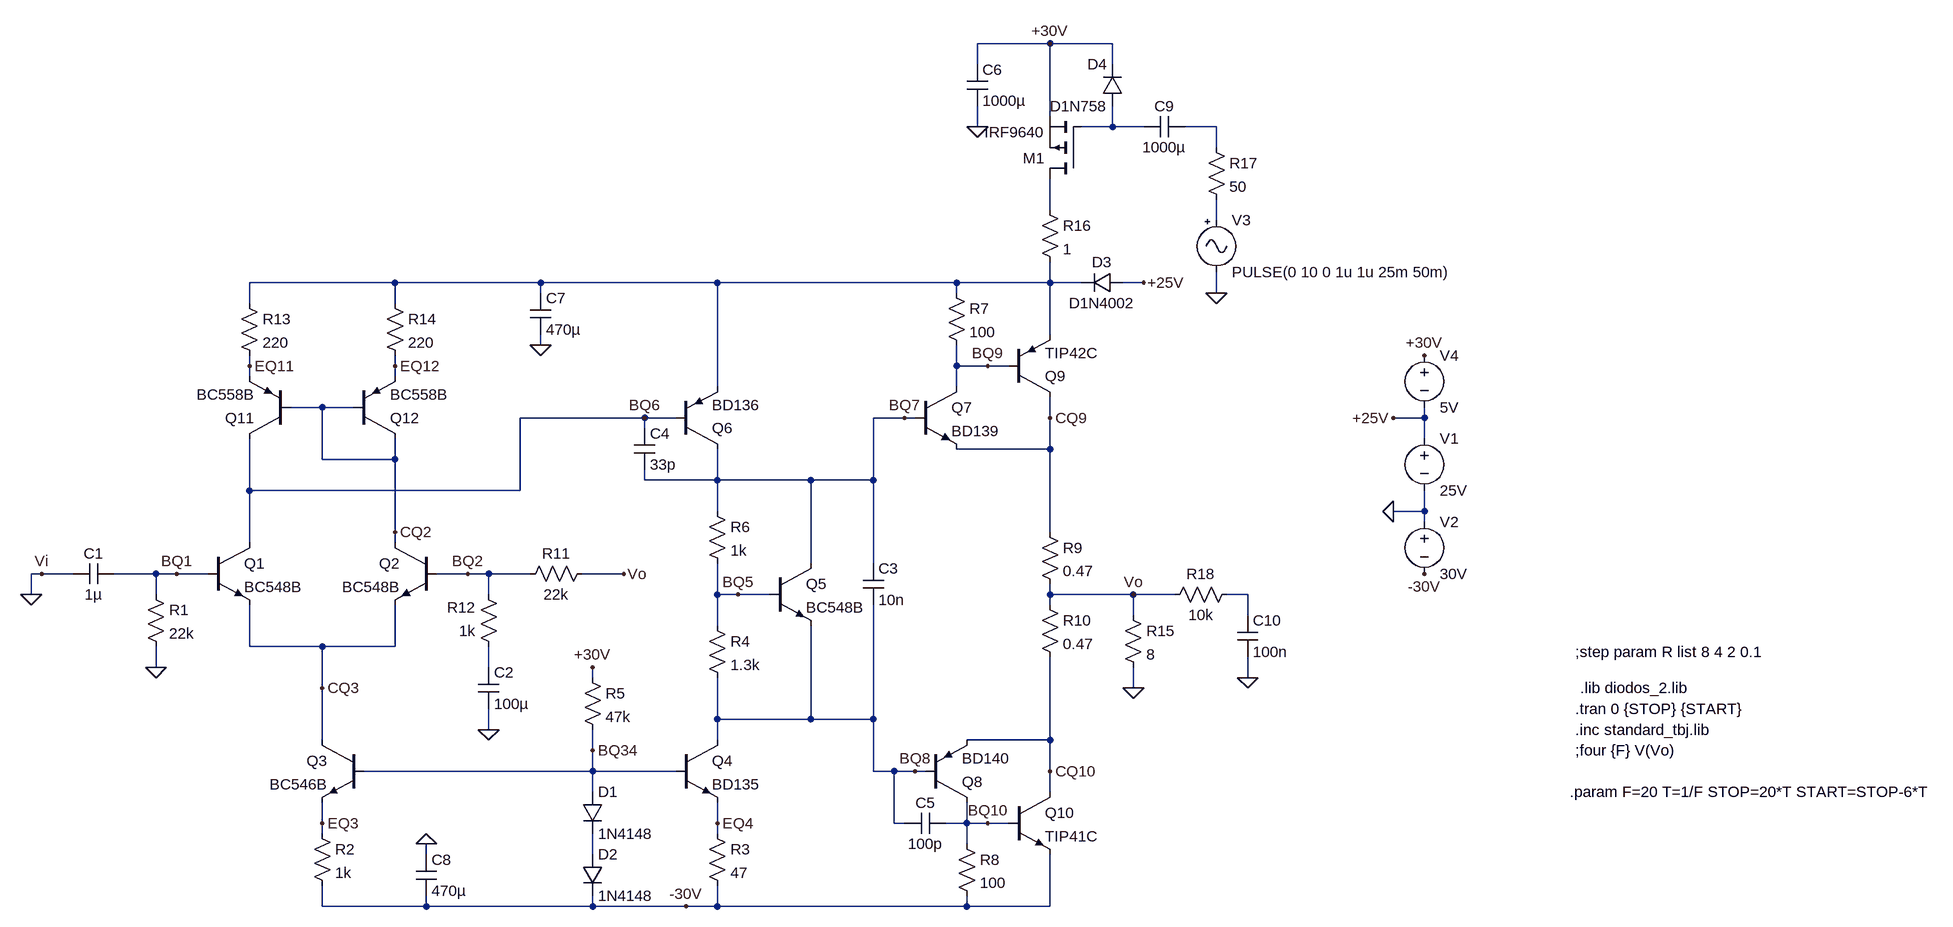
[diagram p0: schematic Clase_B_RRF.asc]
Clase_B_RRF.asc, the LTspice schematic file:
Version 4
SHEET 1 2500 1108
WIRE 1104 -592 992 -592
WIRE 1200 -592 1104 -592
WIRE 992 -560 992 -592
WIRE 1200 -560 1200 -592
WIRE 1104 -480 1104 -592
WIRE 992 -464 992 -496
WIRE 1200 -464 1200 -496
WIRE 1200 -464 1152 -464
WIRE 1248 -464 1200 -464
WIRE 1360 -464 1312 -464
WIRE 1360 -432 1360 -464
WIRE 1104 -336 1104 -384
WIRE 1360 -320 1360 -352
WIRE 96 -224 -128 -224
WIRE 320 -224 96 -224
WIRE 592 -224 320 -224
WIRE 960 -224 592 -224
WIRE 1104 -224 1104 -256
WIRE 1104 -224 960 -224
WIRE 1152 -224 1104 -224
WIRE 1248 -224 1216 -224
WIRE 320 -208 320 -224
WIRE 960 -208 960 -224
WIRE 1360 -208 1360 -240
WIRE -128 -192 -128 -224
WIRE 96 -192 96 -224
WIRE 1104 -144 1104 -224
WIRE 320 -128 320 -144
WIRE -128 -96 -128 -112
WIRE 96 -96 96 -112
WIRE 960 -96 960 -128
WIRE 1008 -96 960 -96
WIRE 1040 -96 1008 -96
WIRE -128 -80 -128 -96
WIRE 96 -80 96 -96
WIRE 592 -64 592 -224
WIRE 960 -64 960 -96
WIRE -16 -32 -64 -32
WIRE 32 -32 -16 -32
WIRE 480 -16 288 -16
WIRE 528 -16 480 -16
WIRE 880 -16 832 -16
WIRE 896 -16 880 -16
WIRE 1104 -16 1104 -48
WIRE 1680 -16 1680 -32
WIRE 1680 -16 1632 -16
WIRE 480 0 480 -16
WIRE 1680 16 1680 -16
WIRE 1104 32 1104 -16
WIRE 1104 32 960 32
WIRE -16 48 -16 -32
WIRE 96 48 96 16
WIRE 96 48 -16 48
WIRE 480 80 480 64
WIRE 592 80 592 32
WIRE 592 80 480 80
WIRE 736 80 592 80
WIRE 832 80 832 -16
WIRE 832 80 736 80
WIRE -128 96 -128 16
WIRE 288 96 288 -16
WIRE 288 96 -128 96
WIRE 592 128 592 80
WIRE 1680 128 1680 96
WIRE 1680 128 1632 128
WIRE 1680 144 1680 128
WIRE 96 160 96 48
WIRE 1104 160 1104 32
WIRE -128 176 -128 96
WIRE 96 176 96 160
WIRE 736 208 736 80
WIRE 832 208 832 80
WIRE -448 224 -464 224
WIRE -400 224 -448 224
WIRE -272 224 -336 224
WIRE -240 224 -272 224
WIRE -192 224 -240 224
WIRE 208 224 160 224
WIRE 240 224 208 224
WIRE 304 224 240 224
WIRE 448 224 384 224
WIRE -464 256 -464 224
WIRE -272 256 -272 224
WIRE 240 256 240 224
WIRE 592 256 592 208
WIRE 624 256 592 256
WIRE 672 256 624 256
WIRE 1104 256 1104 240
WIRE 1232 256 1104 256
WIRE 1296 256 1232 256
WIRE 1408 256 1376 256
WIRE 1104 272 1104 256
WIRE 1232 288 1232 256
WIRE 1408 288 1408 256
WIRE 592 304 592 256
WIRE -128 336 -128 272
WIRE -16 336 -128 336
WIRE 96 336 96 272
WIRE 96 336 -16 336
WIRE -272 368 -272 336
WIRE 240 368 240 336
WIRE 400 384 400 368
WIRE 1408 384 1408 352
WIRE -16 400 -16 336
WIRE 1232 400 1232 368
WIRE 592 448 592 384
WIRE 736 448 736 304
WIRE 736 448 592 448
WIRE 832 448 832 272
WIRE 832 448 736 448
WIRE 240 464 240 432
WIRE -16 480 -16 400
WIRE 592 480 592 448
WIRE 1104 480 1104 352
WIRE 1104 480 976 480
WIRE 400 496 400 464
WIRE 400 528 400 496
WIRE 400 528 48 528
WIRE 528 528 400 528
WIRE 832 528 832 448
WIRE 864 528 832 528
WIRE 896 528 864 528
WIRE 912 528 896 528
WIRE 1104 528 1104 480
WIRE 400 560 400 528
WIRE 1104 560 1104 528
WIRE -16 608 -16 576
WIRE 592 608 592 576
WIRE 864 608 864 528
WIRE 880 608 864 608
WIRE 976 608 976 576
WIRE 976 608 944 608
WIRE 1008 608 976 608
WIRE 1040 608 1008 608
WIRE -16 624 -16 608
WIRE 592 624 592 608
WIRE 976 640 976 608
WIRE 144 656 144 640
WIRE 400 656 400 624
WIRE -16 736 -16 704
WIRE 144 736 144 720
WIRE 144 736 -16 736
WIRE 400 736 400 720
WIRE 400 736 144 736
WIRE 544 736 400 736
WIRE 592 736 592 704
WIRE 592 736 544 736
WIRE 976 736 976 720
WIRE 976 736 592 736
WIRE 1104 736 1104 656
WIRE 1104 736 976 736
FLAG 1632 128 0
FLAG 1680 -112 +30V
FLAG 1104 -592 +30V
FLAG 1680 224 -30V
FLAG 544 736 -30V
FLAG 240 464 0
FLAG -464 256 0
FLAG 1232 256 Vo
FLAG -448 224 Vi
FLAG 480 -16 BQ6
FLAG -16 400 CQ3
FLAG -16 608 EQ3
FLAG 400 496 BQ34
FLAG 592 608 EQ4
FLAG 880 -16 BQ7
FLAG 896 528 BQ8
FLAG 1008 -96 BQ9
FLAG 1008 608 BQ10
FLAG 1104 528 CQ10
FLAG 1104 -16 CQ9
FLAG -272 368 0
FLAG 448 224 Vo
FLAG -128 -96 EQ11
FLAG 96 -96 EQ12
FLAG 96 160 CQ2
FLAG 208 224 BQ2
FLAG -240 224 BQ1
FLAG 624 256 BQ5
FLAG 1232 400 0
FLAG 400 368 +30V
FLAG 320 -128 0
FLAG 144 640 0
FLAG 1360 -208 0
FLAG 1632 -16 +25V
FLAG 992 -464 0
FLAG 1248 -224 +25V
FLAG 1408 384 0
SYMBOL npn -192 176 R0
SYMATTR InstName Q1
SYMATTR Value BC548B
SYMBOL npn 160 176 M0
SYMATTR InstName Q2
SYMATTR Value BC548B
SYMBOL npn 48 480 M0
SYMATTR InstName Q3
SYMATTR Value BC546B
SYMBOL npn 528 480 R0
SYMATTR InstName Q4
SYMATTR Value BD135
SYMBOL npn 672 208 R0
SYMATTR InstName Q5
SYMATTR Value BC548B
SYMBOL pnp 528 32 M180
SYMATTR InstName Q6
SYMATTR Value BD136
SYMBOL res 576 112 R0
SYMATTR InstName R6
SYMATTR Value 1k
SYMBOL res 576 288 R0
SYMATTR InstName R4
SYMATTR Value 1.3k
SYMBOL diode 384 560 R0
SYMATTR InstName D1
SYMATTR Value 1N4148
SYMBOL diode 384 656 R0
SYMATTR InstName D2
SYMATTR Value 1N4148
SYMBOL res -32 608 R0
SYMATTR InstName R2
SYMATTR Value 1k
SYMBOL res 576 608 R0
SYMATTR InstName R3
SYMATTR Value 47
SYMBOL res 384 368 R0
SYMATTR InstName R5
SYMATTR Value 47k
SYMBOL voltage 1680 0 R0
WINDOW 123 0 0 Left 2
WINDOW 39 0 0 Left 2
SYMATTR InstName V1
SYMATTR Value 25V
SYMBOL voltage 1680 128 R0
SYMATTR InstName V2
SYMATTR Value 30V
SYMBOL res 1088 144 R0
SYMATTR InstName R9
SYMATTR Value 0.47
SYMBOL res 1088 256 R0
SYMATTR InstName R10
SYMATTR Value 0.47
SYMBOL npn 896 -64 R0
SYMATTR InstName Q7
SYMATTR Value BD139
SYMBOL pnp 1040 -48 M180
SYMATTR InstName Q9
SYMATTR Value TIP42C
SYMBOL res 944 -224 R0
SYMATTR InstName R7
SYMATTR Value 100
SYMBOL pnp 912 576 M180
SYMATTR InstName Q8
SYMATTR Value BD140
SYMBOL npn 1040 560 R0
SYMATTR InstName Q10
SYMATTR Value TIP41C
SYMBOL res 960 624 R0
SYMATTR InstName R8
SYMATTR Value 100
SYMBOL res 400 208 R90
WINDOW 0 0 56 VBottom 2
WINDOW 3 32 56 VTop 2
SYMATTR InstName R11
SYMATTR Value 22k
SYMBOL res 256 352 R180
WINDOW 0 36 76 Left 2
WINDOW 3 36 40 Left 2
SYMATTR InstName R12
SYMATTR Value 1k
SYMBOL cap 464 0 R0
SYMATTR InstName C4
SYMATTR Value 33p
SYMBOL cap 224 368 R0
SYMATTR InstName C2
SYMATTR Value 100µ
SYMBOL cap -400 240 R270
WINDOW 0 32 32 VTop 2
WINDOW 3 0 32 VBottom 2
SYMATTR InstName C1
SYMATTR Value 1µ
SYMBOL res -288 240 R0
SYMATTR InstName R1
SYMATTR Value 22k
SYMBOL pnp -64 16 R180
SYMATTR InstName Q11
SYMATTR Value BC558B
SYMBOL pnp 32 16 M180
SYMATTR InstName Q12
SYMATTR Value BC558B
SYMBOL res -144 -208 R0
SYMATTR InstName R13
SYMATTR Value 220
SYMBOL res 80 -208 R0
SYMATTR InstName R14
SYMATTR Value 220
SYMBOL cap 944 592 R90
WINDOW 0 0 32 VBottom 2
WINDOW 3 32 32 VTop 2
SYMATTR InstName C5
SYMATTR Value 100p
SYMBOL res 1216 272 R0
SYMATTR InstName R15
SYMATTR Value 8
SYMBOL cap 816 208 R0
SYMATTR InstName C3
SYMATTR Value 10n
SYMBOL cap 304 -208 R0
SYMATTR InstName C7
SYMATTR Value 470µ
SYMBOL cap 128 656 R0
SYMATTR InstName C8
SYMATTR Value 470µ
SYMBOL Misc\\signal 1360 -336 R0
WINDOW 123 0 0 Left 0
WINDOW 39 0 0 Left 0
SYMATTR InstName V3
SYMATTR Value PULSE(0 10 0 1u 1u 25m 50m)
SYMBOL pmos 1152 -384 R180
SYMATTR InstName M1
SYMATTR Value IRF9640
SYMBOL res 1088 -352 R0
SYMATTR InstName R16
SYMATTR Value 1
SYMBOL diode 1216 -240 R90
WINDOW 0 0 32 VBottom 2
WINDOW 3 32 32 VTop 2
SYMATTR InstName D3
SYMATTR Value D1N4002
SYMBOL diode 1216 -496 R180
WINDOW 0 24 64 Left 2
WINDOW 3 24 0 Left 2
SYMATTR InstName D4
SYMATTR Value D1N758
SYMBOL cap 976 -560 R0
SYMATTR InstName C6
SYMATTR Value 1000µ
SYMBOL cap 1312 -480 R90
WINDOW 0 0 32 VBottom 2
WINDOW 3 32 32 VTop 2
SYMATTR InstName C9
SYMATTR Value 1000µ
SYMBOL res 1344 -448 R0
SYMATTR InstName R17
SYMATTR Value 50
SYMBOL voltage 1680 -128 R0
SYMATTR InstName V4
SYMATTR Value 5V
SYMBOL res 1392 240 R90
WINDOW 0 0 56 VBottom 2
WINDOW 3 32 56 VTop 2
SYMATTR InstName R18
SYMATTR Value 10k
SYMBOL cap 1392 288 R0
SYMATTR InstName C10
SYMATTR Value 100n
TEXT 1912 464 Left 2 !.inc standard_tbj.lib
TEXT 1912 496 Left 2 !;four {F} V(Vo)
TEXT 1904 560 Left 2 !.param F=20 T=1/F STOP=20*T START=STOP-6*T
TEXT 1912 432 Left 2 !.tran 0 {STOP} {START}
TEXT 1912 344 Left 2 !;step param R list 8 4 2 0.1
TEXT 1920 400 Left 2 !.lib diodos_2.lib

The netlist it stands for:
* Clase_B_RRF.asc
Q1 BQ6 BQ1 CQ3 0 BC548B
Q2 CQ2 BQ2 CQ3 0 BC548B
Q3 CQ3 BQ34 EQ3 0 BC546B
Q4 BQ8 BQ34 EQ4 0 BD135
Q5 BQ7 BQ5 BQ8 0 BC548B
Q6 BQ7 BQ6 N005 0 BD136
R6 BQ7 BQ5 1k
R4 BQ5 BQ8 1.3k
D1 BQ34 N008 1N4148
D2 N008 -30V 1N4148
R2 EQ3 -30V 1k
R3 EQ4 -30V 47
R5 +30V BQ34 47k
V1 +25V 0 25V
V2 0 -30V 30V
R9 CQ9 Vo 0.47
R10 Vo CQ10 0.47
Q7 BQ9 BQ7 CQ9 0 BD139
Q9 CQ9 BQ9 N005 0 TIP42C
R7 N005 BQ9 100
Q8 BQ10 BQ8 CQ10 0 BD140
Q10 CQ10 BQ10 -30V 0 TIP41C
R8 BQ10 -30V 100
R11 Vo BQ2 22k
R12 N007 BQ2 1k
C4 BQ6 BQ7 33p
C2 N007 0 100µ
C1 0 BQ1 1µ
R1 BQ1 0 22k
Q11 BQ6 CQ2 EQ11 0 BC558B
Q12 CQ2 CQ2 EQ12 0 BC558B
R13 N005 EQ11 220
R14 N005 EQ12 220
C5 BQ10 BQ8 100p
R15 Vo 0 8
C3 BQ7 BQ8 10n
C7 N005 0 470µ
C8 0 -30V 470µ
V3 N004 0 PULSE(0 10 0 1u 1u 25m 50m)
M1 N003 N001 +30V +30V IRF9640
R16 N003 N005 1
D3 +25V N005 D1N4002
D4 N001 +30V D1N758
C6 +30V 0 1000µ
C9 N002 N001 1000µ
R17 N002 N004 50
V4 +30V +25V 5V
R18 N006 Vo 10k
C10 N006 0 100n
.model D D
.lib standard.dio
.model NPN NPN
.model PNP PNP
.lib standard.bjt
.model NMOS NMOS
.model PMOS PMOS
.lib standard.mos
.inc standard_tbj.lib
;four {F} V(Vo)
.param F=20 T=1/F STOP=20*T START=STOP-6*T
.tran 0 {STOP} {START}
;step param R list 8 4 2 0.1
.lib diodos_2.lib
.backanno
.end